# EAGLE design 3PDT Switch Breakout (EAGLE 9.3.1)
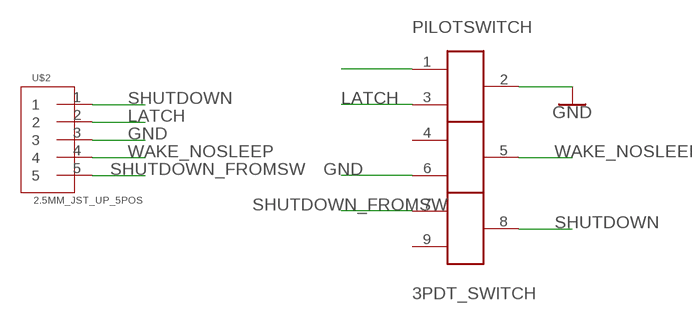
[diagram p0: schematic, sheet 1]

## Parts
PILOTSWITCH  3PDT_SWITCH  [3PDT_SWITCH_SMD]
U$2  2.5MM_JST_UP_5POS  [JST_5POS_2.5MM_UP]

## Nets
GND: PILOTSWITCH.2 PILOTSWITCH.6 U$2.3
LATCH: PILOTSWITCH.3 U$2.2
N$3: PILOTSWITCH.1
SHUTDOWN: PILOTSWITCH.8 U$2.1
SHUTDOWN_FROMSW: PILOTSWITCH.7 U$2.5
WAKE_NOSLEEP: PILOTSWITCH.5 U$2.4
Unconnected: PILOTSWITCH.4 PILOTSWITCH.9

## Library data of the parts
PILOTSWITCH = eDNA:3PDT_SWITCH
U$2 = eDNA:2.5MM_JST_UP_5POS: 2.5MM JST 5POS, 5 Position, up https://www.digikey.com/product-detail/en/jst-sales-america-inc/B5B-XH-A-LF-SN/455-2270-ND/1530483

## Board
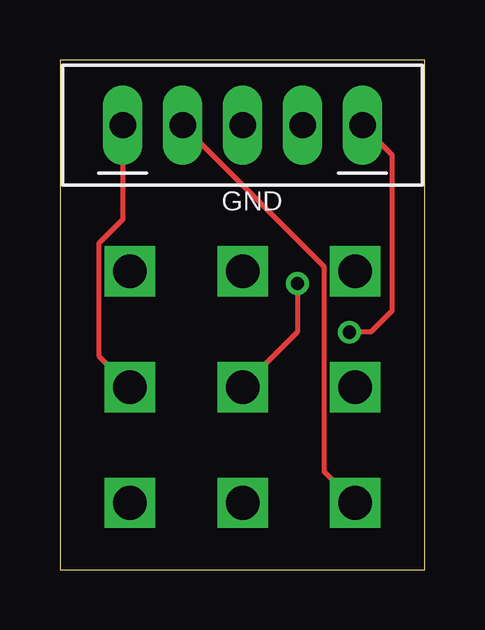
[diagram p1: board, top side]
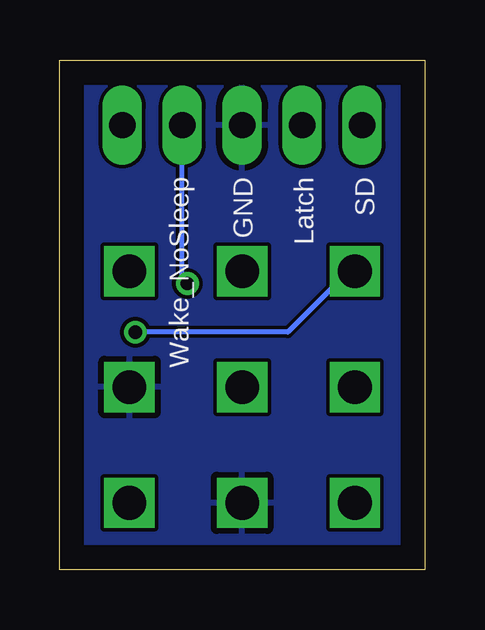
[diagram p2: board, bottom side, seen from below]

Size 15.22 x 21.26 mm. Coordinates in mm from the lower left corner, seen from the top.
Outline: 0,0 15.22,0 15.22,21.26 0,21.26 0,0
Copper layers (1*16): Top 0.035mm / dielectric 1.5mm / Bottom 0.035mm
Design rules "default": minimum track width 6mil, minimum drill 0.35mm, track to track 6mil, track to pad 6mil, pad to pad 6mil, via to via 6mil, smd to smd 6mil, copper to edge 40mil, drill to drill 6mil, minimum pad ring 10mil, minimum via ring 8mil, stop-mask expansion 4mil, vias tented up to drill 0mil, thermal gap 10mil

### Footprints (pad centres in the part's own frame; a part is rotated, then mirrored left to right if it is on the bottom)
3PDT_SWITCH_SMD = drill 1.4 square: 1 4.7,4.83; 2 4.7,0; 3 4.7,-4.83; 4 0,4.83; 5 0,0; 6 0,-4.83; 7 -4.7,4.83; 8 -4.7,0; 9 -4.7,-4.83
JST_5POS_2.5MM_UP = drill 1.1 long: 1 -5,0; 2 -2.5,0; 3 0,0; 4 2.5,0; 5 5,0

### Placement (x,y rotation side)
PILOTSWITCH  7.62,7.62 0 top
U$2  7.62,18.54 0 top

### Tracks (layer width: path | path; a pad name or v marks a point on that pad's centre or on a via)
GND
  pour Bottom: 0,21.59 15.24,21.59 15.24,0 0,0
LATCH
  Top 0.203: U$2.2 11.02,12.65 11.02,4.09 PILOTSWITCH.3
SHUTDOWN
  Top 0.203: U$2.1 2.62,14.61 1.62,13.61 1.62,8.92 PILOTSWITCH.8
SHUTDOWN_FROMSW  (via drill 0.55)
  Top 0.203: U$2.5 13.85,17.31 13.85,10.79 12.96,9.91 v12.07,9.91
  Bottom 0.203: PILOTSWITCH.7 3.17,12.45 5.71,9.91 v12.07,9.91
WAKE_NOSLEEP  (via drill 0.55)
  Top 0.203: v9.91,11.94 9.91,9.91 PILOTSWITCH.5
  Bottom 0.203: v9.91,11.94 10.12,12.15 U$2.4

### Text on the board
tPlace: GND
bPlace: SD | Latch | GND | Wake_NoSleep
tDocu: ON ON